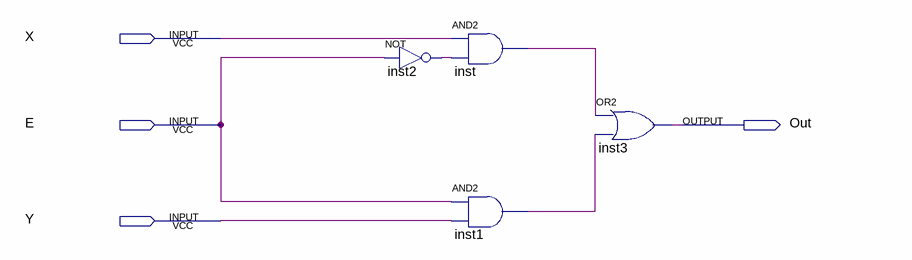
[diagram p0: schematic sheet]
// Quartus schematic Select.bdf as structural Verilog: 4 symbols, 4 pins
module Select (
  input  X,
  input  E,
  input  Y,
  output Out
);

  wire inst1_out, inst2_out, inst_out;

  not inst2 (inst2_out, E);
  and inst (inst_out, X, inst2_out);
  and inst1 (inst1_out, E, Y);
  or inst3 (Out, inst_out, inst1_out);
endmodule
